# EAGLE schematic LightSwitch (EAGLE 8.0.1)
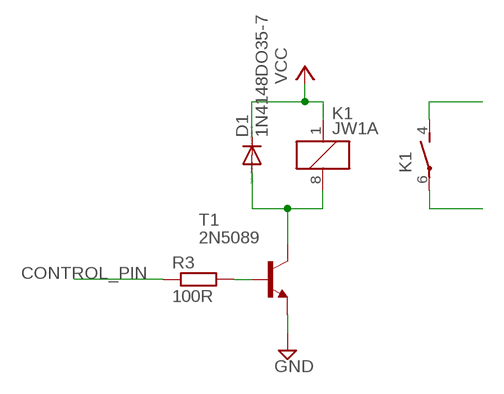
[diagram p0: schematic, sheet 1]

## Parts
D1  1N4148DO35-7  [DO35-7]
K1  JW1A  [JW1A]
R3  100R  R-EU_0204/5  [0204/5]
T1  2N5089  [TO92]

## Nets
CONTROL_PIN: R3.1
GND: T1.3(E)
N$4: R3.2 T1.2(B)
N$6: D1.A K1.8 T1.1(C)
N$8: K1.6(1:P)
N$9: K1.4(1:S)
VCC: D1.C K1.1

## Library data of the parts
D1 = diode:1N4148: DIODE high speed (Philips)
K1 = relay:JW1A: Power relay Source: Panasonic Electric Works Co., Ltd. / jw.catalog.pdf
R3 = resistor:R-EU_: RESISTOR, European symbol
T1 = transistor:2N5089: NPN TRANSISTOR